# EAGLE design D1 Mini Pixel Shield V1.0 (EAGLE 9.3.0)
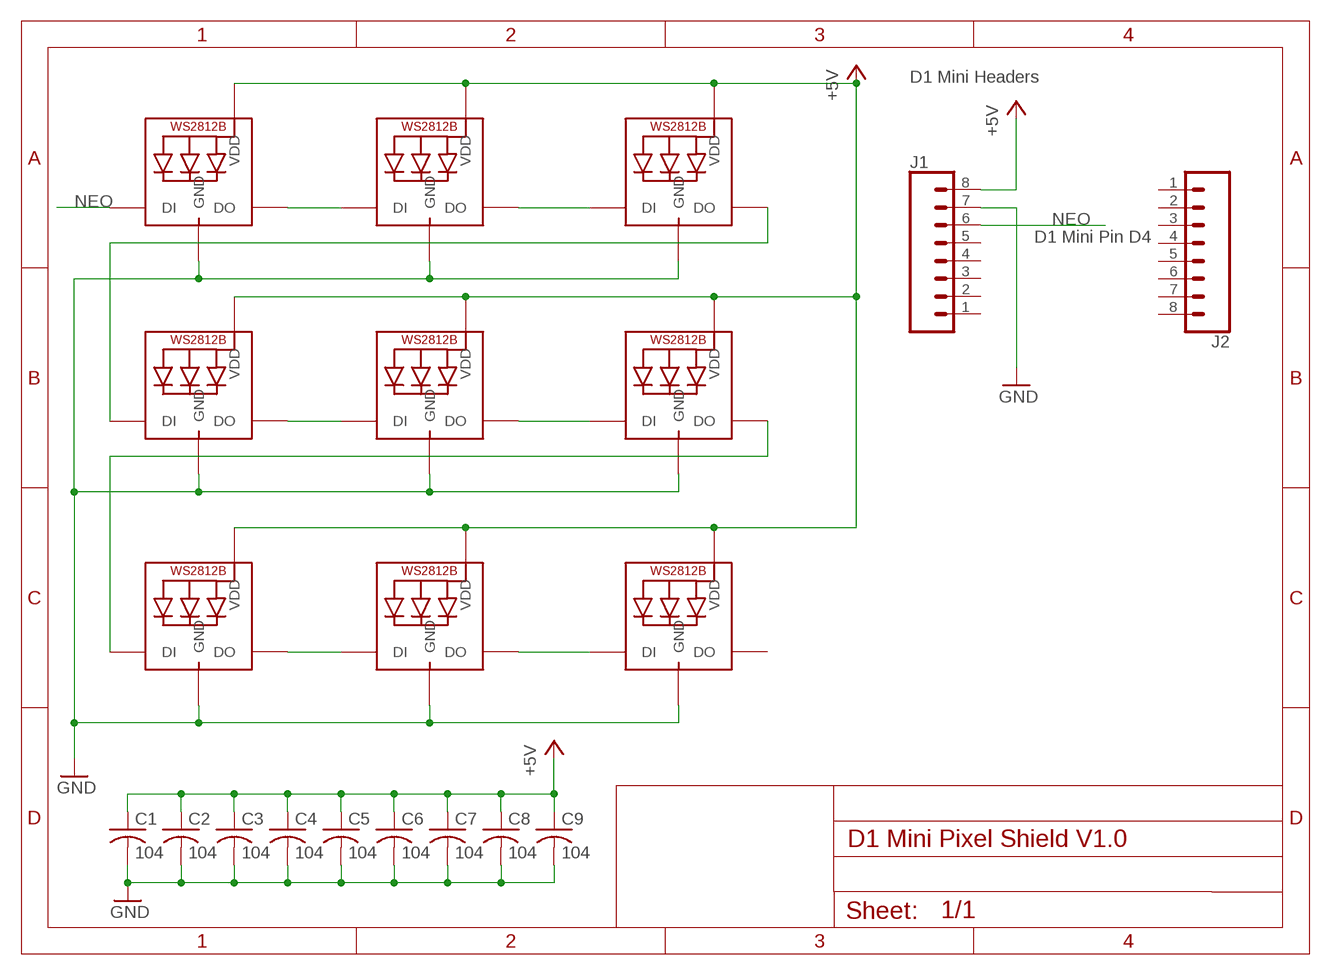
[diagram p0: schematic, sheet 1]

## Parts
C1  104  C-USC0603  [C0603]
C2  104  C-USC0603  [C0603]
C3  104  C-USC0603  [C0603]
C4  104  C-USC0603  [C0603]
C5  104  C-USC0603  [C0603]
C6  104  C-USC0603  [C0603]
C7  104  C-USC0603  [C0603]
C8  104  C-USC0603  [C0603]
C9  104  C-USC0603  [C0603]
J1  CONN_08"  [1X08]
J2  CONN_08"  [1X08]
LED1  WS2812B_5050N  [WS2812B-NARROW]
LED2  WS2812B_5050N  [WS2812B-NARROW]
LED3  WS2812B_5050N  [WS2812B-NARROW]
LED4  WS2812B_5050N  [WS2812B-NARROW]
LED5  WS2812B_5050N  [WS2812B-NARROW]
LED6  WS2812B_5050N  [WS2812B-NARROW]
LED7  WS2812B_5050N  [WS2812B-NARROW]
LED8  WS2812B_5050N  [WS2812B-NARROW]
LED9  WS2812B_5050N  [WS2812B-NARROW]

## Nets
+5V: C1.1 C2.1 C3.1 C4.1 C5.1 C6.1 C7.1 C8.1 C9.1 J1.8 LED1.1-VDD(VDD) LED2.1-VDD(VDD) LED3.1-VDD(VDD) LED4.1-VDD(VDD) LED5.1-VDD(VDD) LED6.1-VDD(VDD) LED7.1-VDD(VDD) LED8.1-VDD(VDD) LED9.1-VDD(VDD)
GND: C1.2 C2.2 C3.2 C4.2 C5.2 C6.2 C7.2 C8.2 C9.2 J1.7 LED1.3-GND(GND) LED2.3-GND(GND) LED3.3-GND(GND) LED4.3-GND(GND) LED5.3-GND(GND) LED6.3-GND(GND) LED7.3-GND(GND) LED8.3-GND(GND) LED9.3-GND(GND)
N$1: LED1.2-DOUT(DO) LED2.4-DIN(DI)
N$2: LED2.2-DOUT(DO) LED3.4-DIN(DI)
N$3: LED4.2-DOUT(DO) LED5.4-DIN(DI)
N$4: LED5.2-DOUT(DO) LED6.4-DIN(DI)
N$5: LED7.2-DOUT(DO) LED8.4-DIN(DI)
N$6: LED8.2-DOUT(DO) LED9.4-DIN(DI)
N$8: LED3.2-DOUT(DO) LED4.4-DIN(DI)
N$9: LED6.2-DOUT(DO) LED7.4-DIN(DI)
NEO: J1.6 LED1.4-DIN(DI)
Unconnected: J1.1 J1.2 J1.3 J1.4 J1.5 J2.1 J2.2 J2.3 J2.4 J2.5 J2.6 J2.7 J2.8 LED9.2-DOUT(DO)

## Notes on the sheet
- D1 Mini Headers
- D1 Mini Pin D4

## Library data of the parts
C1-C9 = adafruit:C-US: CAPACITOR, American symbol
J1 J2 = SparkFun-Connectors:CONN_08: Multi connection point. Often used as Generic Header-pin footprint for 0.1 inch spaced/style header connections On any of the 0.1 inch spaced packages, you can populate with these: Break Away Headers - Straight <https://www.sparkfun.com/products/116> (PRT-00116) Break Away Male Headers - Right Angle <https://www.sparkfun.com/products/553> (PRT-00553) Female Headers <https://www.sparkfun.com/products/115> (PRT-00115) Break Away Headers - Machine Pin <https://www.sparkfun.com/products/117> (PRT-00117) Break Away Female Headers - Swiss Machine Pin <https://www.sparkfun.com/products/743> (PRT-00743) Arduino Stackable Header - 8 Pin <https://www.sparkfun.com/products/9279> (PRT-09279) For SCREWTERMINALS and SPRING TERMINALS visit here: Screw Terimnals on SparkFun.com <https://www.sparkfun.com/search/results?term=Screw+Terminals> (5mm/3.5mm/2.54mm spacing) This device is also useful as a general connection point to wire up your design to another part of your project. Our various solder wires solder well into these plated through hole pads. Hook-Up Wire - Assortment (Stranded, 22 AWG) <https://www.sparkfun.com/products/11375> (PRT-11375) Hook-Up Wire - Assortment (Solid Core, 22 AWG) <https://www.sparkfun.com/products/11367> (PRT-11367) View the entire wire category on our website here <https://www.sparkfun.com/categories/141> Special notes: Molex polarized connector foot print use with SKU : PRT-08231 with associated crimp pins and housings. 1MM SMD Version SKU: PRT-10208 NOTES ON THE VARIANTS LOCK and LOCK_LONGPADS... This footprint was designed to help hold the alignment of a through-hole component (i.e. 6-pin header) while soldering it into place. You may notice that each hole has been shifted either up or down by 0.005 of an inch from it's more standard position (which is a perfectly straight line). This slight alteration caused the pins (the squares in the middle) to touch the edges of the holes. Because they are alternating, it causes a "brace" to hold the component in place. 0.005 has proven to be the perfect amount of "off-center" position when using our standard breakaway headers. Although looks a little odd when you look at the bare footprint, once you have a header in there, the alteration is very hard to notice. Also,if you push a header all the way into place, it is covered up entirely on the bottom side.; PROD_ID: CONN-08438
LED1-LED9 = adafruit:WS2812B

## Board
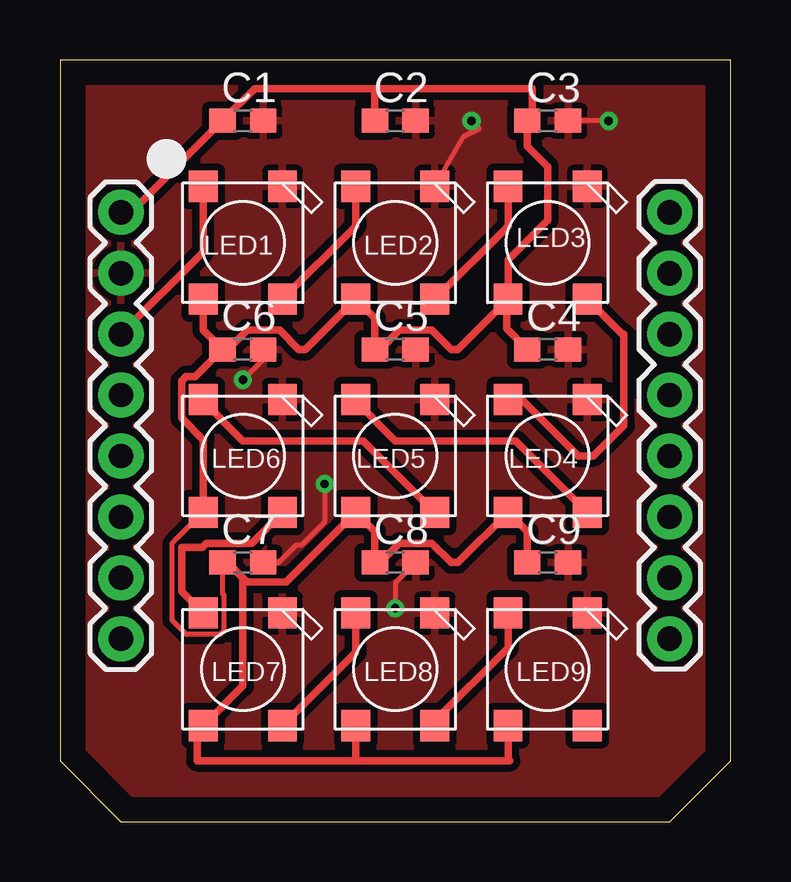
[diagram p1: board, top side]
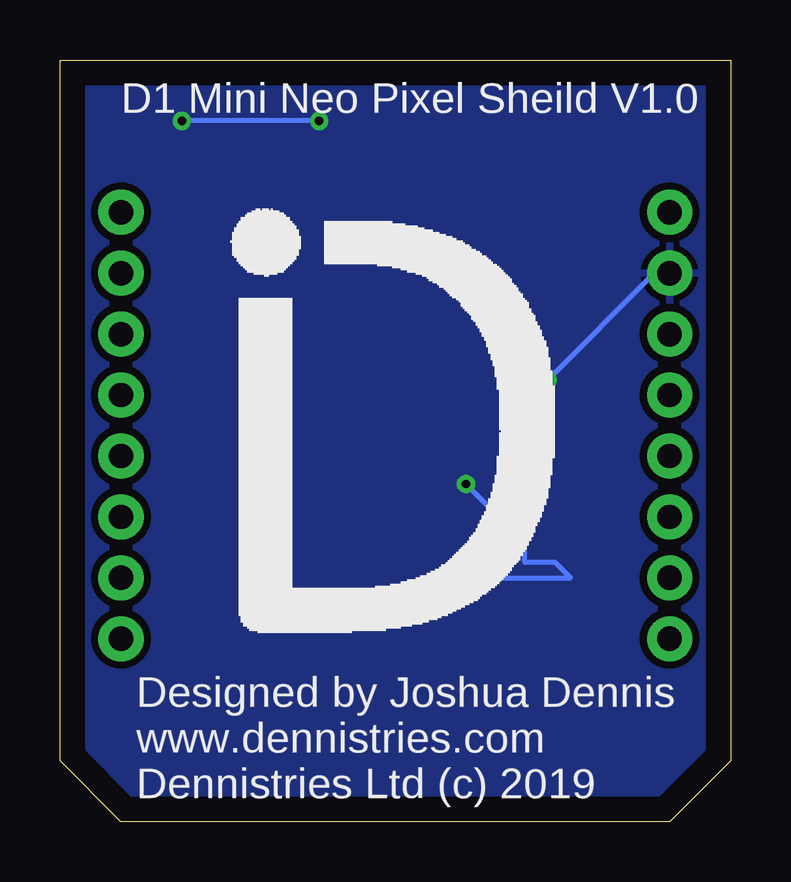
[diagram p2: board, bottom side, seen from below]

Size 27.94 x 31.75 mm. Coordinates in mm from the lower left corner, seen from the top.
Outline: 2.54,0 25.4,0 27.94,2.54 27.94,31.75 0,31.75 0,2.54 2.54,0
Copper layers (1*16): Top 0.035mm / dielectric 1.5mm / Bottom 0.035mm
Design rules "default": minimum track width 6mil, minimum drill 0.35mm, track to track 6mil, track to pad 6mil, pad to pad 6mil, via to via 6mil, smd to smd 6mil, copper to edge 40mil, drill to drill 6mil, minimum pad ring 10mil, minimum via ring 8mil, stop-mask expansion 4mil, vias tented up to drill 0mil, thermal gap 10mil

### Footprints (pad centres in the part's own frame; a part is rotated, then mirrored left to right if it is on the bottom)
C0603 = smd 1.1 x 1: 1 -0.85,0; 2 0.85,0
1X08 = drill 1.016 pad 1.88: 1 0,0; 2 2.54,0; 3 5.08,0; 4 7.62,0; 5 10.16,0; 6 12.7,0; 7 15.24,0; 8 17.78,0
WS2812B-NARROW = smd 1.3 x 1.2: 1-VDD 2.35,-1.65; 2-DOUT 2.35,1.65; 3-GND -2.35,1.65; 4-DIN -2.35,-1.65

### Placement (x,y rotation side)
C1  7.62,29.21 0 top
C2  13.97,29.21 0 top
C3  20.32,29.21 0 top
C4  20.32,19.68 0 top
C5  13.97,19.68 0 top
C6  7.62,19.68 0 top
C7  7.62,10.79 0 top
C8  13.97,10.79 0 top
C9  20.32,10.79 0 top
J1  2.54,7.62 90 top
J2  25.4,25.4 270 top
LED1  7.62,24.13 270 top
LED2  13.97,24.13 270 top
LED3  20.32,24.13 270 top
LED4  20.32,15.24 270 top
LED5  13.97,15.24 270 top
LED6  7.62,15.24 270 top
LED7  7.62,6.35 270 top
LED8  13.97,6.35 270 top
LED9  20.32,6.35 270 top

### Tracks (layer width: path | path; a pad name or v marks a point on that pad's centre or on a via)
+5V
  Top 0.203: LED6.1-VDD 4.92,11.84 4.91,11.84 4.67,11.6 4.67,8.39 5.26,7.8 6.67,7.8 6.82,7.95 6.82,9.46 6.77,9.51 C7.1
  Top 0.305: 18.61,21.72 16.57,19.68 16.3,19.68 15.5,20.49 14.14,20.49 13.34,19.68 C5.1 13.12,20.98 LED2.1-VDD 10.22,19.68 9.95,19.68 9.15,20.49 7.79,20.49 6.99,19.68 C6.1 | 18.61,21.72 LED3.1-VDD 18.67,23.43 20.32,25.08 20.32,27.3 19.47,28.16 C3.1 19.68,29.43 19.68,30.56 13.34,30.56 | J1.8 2.96,25.4 C1.1 8.12,30.56 13.34,30.56 | C2.1 13.12,30.34 13.34,30.56 | 12.38,2.54 5.71,2.54 5.71,3.75 LED7.1-VDD 7.62,5.65 7.62,10.16 | 12.38,2.54 18.73,2.54 18.67,2.6 LED9.1-VDD | LED8.1-VDD 12.32,2.6 12.38,2.54 | C7.1 6.99,10.79 7.62,10.16 | 7.62,10.16 7.79,9.99 9.42,9.99 LED5.1-VDD 13.12,12.09 C8.1 13.34,10.79 14.14,11.6 15.5,11.6 16.3,10.79 16.57,10.79 LED4.1-VDD 19.47,12.09 C9.1 | LED6.1-VDD 5.97,15.91 5.07,16.81 5.07,18.37 5.24,18.55 5.63,18.55 C6.1 | LED1.1-VDD 5.97,20.48 C6.1 | C4.1 18.61,20.55 18.61,21.72
GND  (via drill 0.35)
  Top 0.203: C6.2 8.47,19.27 v7.62,18.41 | C8.2 13.97,9.95 v13.97,8.89 | v11.03,14.07 11.03,12.49 10.06,11.52 9.83,11.52 9.11,10.79 C7.2 | LED2.3-GND 16.83,28.57 17.46,28.89 v17.14,29.21 | v22.86,29.21 C3.2
  Bottom 0.203: v7.62,18.41 3.17,22.86 J1.7 | v13.97,8.89 12.7,10.16 6.67,10.16 7.3,10.79 8.57,10.79 8.57,11.62 v11.03,14.07 | v17.14,29.21 v22.86,29.21
  pour Top (isolate 0.305): 0,0 27.94,0 27.94,31.75 0,31.75 0,2.22
  pour Bottom (isolate 0.305): 0,0 25.4,0 27.94,2.54 27.94,31.43 0.32,31.43 0,31.75
N$1
  Top 0.305: LED1.2-DOUT 12.32,24.83 LED2.4-DIN
N$2
  Top 0.305: LED2.2-DOUT 18.67,24.83 LED3.4-DIN
N$3
  Top 0.305: LED4.2-DOUT 18.98,15.88 13.97,15.88 12.32,17.52 LED5.4-DIN
N$4
  Top 0.305: LED5.2-DOUT 12.63,15.88 7.62,15.88 5.97,17.52 LED6.4-DIN
N$5
  Top 0.305: LED7.2-DOUT 12.32,7.05 LED8.4-DIN
N$6
  Top 0.305: LED8.2-DOUT 15.62,4.19 18.67,7.24 LED9.4-DIN
N$8
  Top 0.305: LED4.4-DIN 19.24,17.59 21.59,15.24 22.23,15.24 23.5,16.51 23.5,20.32 23.43,20.32 LED3.2-DOUT
N$9
  Top 0.305: LED6.2-DOUT 7.98,11.6 6.09,11.6 5.92,11.43 5.08,11.43 5.08,9.59 LED7.4-DIN
NEO
  Top 0.305: J1.6 5.97,23.75 LED1.4-DIN

### Text on the board
bPlace: D1 Mini Neo Pixel Sheild V1.0 | Designed by Joshua Dennis | www.dennistries.com | Dennistries Ltd (c) 2019